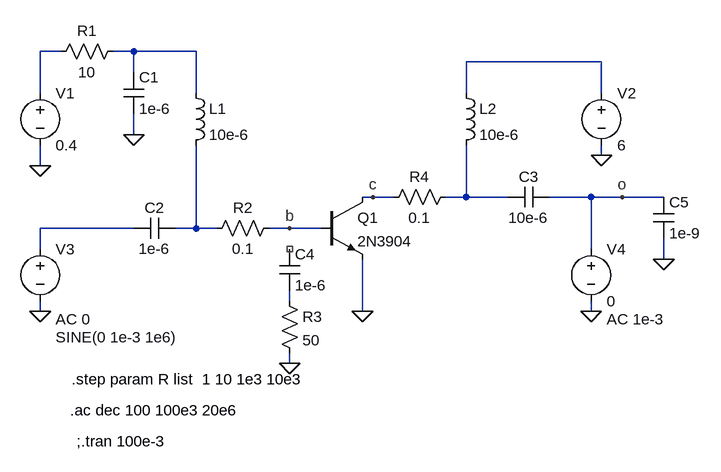
[diagram p0: schematic bjt_modelo.asc]
bjt_modelo.asc, the LTspice schematic file:
Version 4
SHEET 1 880 680
WIRE -272 -112 -304 -112
WIRE -160 -112 -192 -112
WIRE -64 -112 -160 -112
WIRE 560 -96 352 -96
WIRE -160 -80 -160 -112
WIRE -304 -48 -304 -112
WIRE -64 -48 -64 -112
WIRE 352 -48 352 -96
WIRE 560 -48 560 -96
WIRE -160 16 -160 -16
WIRE 560 48 560 32
WIRE -304 64 -304 32
WIRE 208 112 192 112
WIRE 240 112 208 112
WIRE 352 112 352 32
WIRE 352 112 320 112
WIRE 416 112 352 112
WIRE 544 112 480 112
WIRE 592 112 544 112
WIRE 656 112 592 112
WIRE -160 160 -304 160
WIRE -64 160 -64 32
WIRE -64 160 -96 160
WIRE -32 160 -64 160
WIRE 80 160 48 160
WIRE 128 160 80 160
WIRE -304 192 -304 160
WIRE 544 192 544 112
WIRE 656 208 656 176
WIRE 80 272 80 256
WIRE -304 288 -304 272
WIRE 192 288 192 208
WIRE 544 288 544 272
WIRE 80 368 80 352
FLAG 192 288 0
FLAG -304 64 0
FLAG 560 48 0
FLAG 544 288 0
FLAG -304 288 0
FLAG -160 16 0
FLAG 80 160 b
FLAG 208 112 c
FLAG 80 368 0
FLAG 656 208 0
FLAG 592 112 o
SYMBOL npn 128 112 R0
SYMATTR InstName Q1
SYMATTR Value 2N3904
SYMBOL ind -80 -64 R0
SYMATTR InstName L1
SYMATTR Value 10e-6
SYMBOL ind 336 -64 R0
SYMATTR InstName L2
SYMATTR Value 10e-6
SYMBOL cap -96 144 R90
WINDOW 0 0 32 VBottom 2
WINDOW 3 32 32 VTop 2
SYMATTR InstName C2
SYMATTR Value 1e-6
SYMBOL cap 480 96 R90
WINDOW 0 0 32 VBottom 2
WINDOW 3 32 32 VTop 2
SYMATTR InstName C3
SYMATTR Value 10e-6
SYMBOL voltage -304 -64 R0
WINDOW 123 0 0 Left 0
WINDOW 39 0 0 Left 0
SYMATTR InstName V1
SYMATTR Value 0.4
SYMBOL voltage 560 -64 R0
WINDOW 123 0 0 Left 0
WINDOW 39 0 0 Left 0
SYMATTR InstName V2
SYMATTR Value 6
SYMBOL voltage -304 176 R0
WINDOW 3 24 152 Left 2
WINDOW 123 24 124 Left 2
WINDOW 39 0 0 Left 0
SYMATTR InstName V3
SYMATTR Value SINE(0 1e-3 1e6)
SYMATTR Value2 AC 0
SYMBOL res -176 -128 R90
WINDOW 0 0 56 VBottom 2
WINDOW 3 32 56 VTop 2
SYMATTR InstName R1
SYMATTR Value 10
SYMBOL cap -176 -80 R0
SYMATTR InstName C1
SYMATTR Value 1e-6
SYMBOL res -48 176 R270
WINDOW 0 32 56 VTop 2
WINDOW 3 0 56 VBottom 2
SYMATTR InstName R2
SYMATTR Value 0.1
SYMBOL cap 64 192 R0
SYMATTR InstName C4
SYMATTR Value 1e-6
SYMBOL res 64 256 R0
SYMATTR InstName R3
SYMATTR Value 50
SYMBOL res 336 96 R90
WINDOW 0 0 56 VBottom 2
WINDOW 3 32 56 VTop 2
SYMATTR InstName R4
SYMATTR Value 0.1
SYMBOL voltage 544 176 R0
WINDOW 123 24 124 Left 2
WINDOW 39 0 0 Left 0
SYMATTR InstName V4
SYMATTR Value 0
SYMATTR Value2 AC 1e-3
SYMBOL cap 640 112 R0
SYMATTR InstName C5
SYMATTR Value 1e-9
TEXT -258 440 Left 2 !.ac dec 100 100e3 20e6
TEXT -248 488 Left 2 !;.tran 100e-3
TEXT -256 392 Left 2 !.step param R list  1 10 1e3 10e3

The netlist it stands for:
* bjt_modelo.asc
Q1 c b 0 0 2N3904
L1 N002 N006 10e-6
L2 N003 N004 10e-6
C2 N006 N005 1e-6
C3 o N004 10e-6
V1 N001 0 0.4
V2 N003 0 6
V3 N005 0 SINE(0 1e-3 1e6) AC 0
R1 N002 N001 10
C1 N002 0 1e-6
R2 N006 b 0.1
C4 NC_01 N007 1e-6
R3 N007 0 50
R4 N004 c 0.1
V4 o 0 0 AC 1e-3
C5 o 0 1e-9
.model NPN NPN
.model PNP PNP
.lib standard.bjt
.ac dec 100 100e3 20e6
;.tran 100e-3
.step param R list  1 10 1e3 10e3
.backanno
.end